# Altium schematic sheet GPIO_Headers.SchDoc: Headers
size A4; DocumentNumber: 8; Revision: 1.0; SheetNumber: 8; SheetTotal: 8; SheetSize: A4
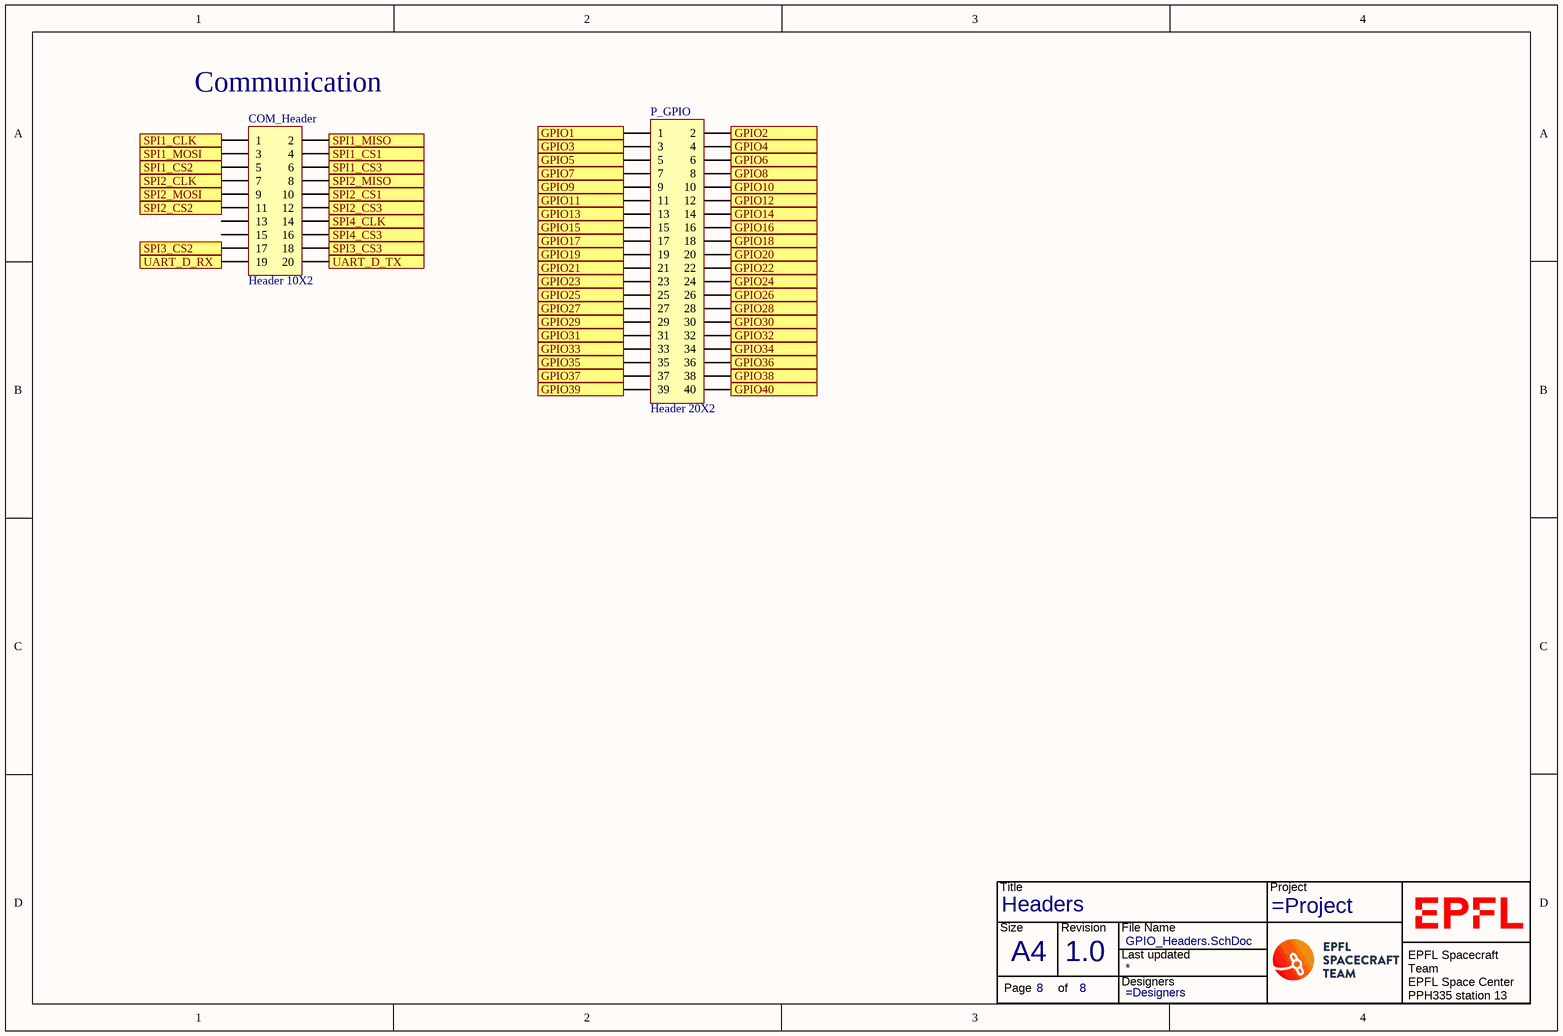
[diagram p0: GPIO_Headers.SchDoc]

## Parts
*  TitleBlock  (value not drawn)  (graphical)
COM_Header  Header 10X2  [HDR2X10]
P_GPIO  Header 20X2  [HDR2X20]

## Ports
GPIO1, GPIO2, GPIO3, GPIO4, GPIO5, GPIO6, GPIO7, GPIO8, GPIO9, GPIO10, GPIO11, GPIO12, GPIO13, GPIO14, GPIO15, GPIO16, GPIO17, GPIO18, GPIO19, GPIO20, GPIO21, GPIO22, GPIO23, GPIO24, GPIO25, GPIO26, GPIO27, GPIO28, GPIO29, GPIO30, GPIO31, GPIO32, GPIO33, GPIO34, GPIO35, GPIO36, GPIO37, GPIO38, GPIO39, GPIO40, SPI1_CLK, SPI1_CS1, SPI1_CS2, SPI1_CS3, SPI1_MISO, SPI1_MOSI, SPI2_CLK, SPI2_CS1, SPI2_CS2, SPI2_CS3, SPI2_MISO, SPI2_MOSI, SPI3_CS2, SPI3_CS3, SPI4_CLK, SPI4_CS3, UART_D_RX, UART_D_TX

## Nets
GPIO1: P_GPIO.1 ; port GPIO1
GPIO2: P_GPIO.2 ; port GPIO2
GPIO3: P_GPIO.3 ; port GPIO3
GPIO4: P_GPIO.4 ; port GPIO4
GPIO5: P_GPIO.5 ; port GPIO5
GPIO6: P_GPIO.6 ; port GPIO6
GPIO7: P_GPIO.7 ; port GPIO7
GPIO8: P_GPIO.8 ; port GPIO8
GPIO9: P_GPIO.9 ; port GPIO9
GPIO10: P_GPIO.10 ; port GPIO10
GPIO11: P_GPIO.11 ; port GPIO11
GPIO12: P_GPIO.12 ; port GPIO12
GPIO13: P_GPIO.13 ; port GPIO13
GPIO14: P_GPIO.14 ; port GPIO14
GPIO15: P_GPIO.15 ; port GPIO15
GPIO16: P_GPIO.16 ; port GPIO16
GPIO17: P_GPIO.17 ; port GPIO17
GPIO18: P_GPIO.18 ; port GPIO18
GPIO19: P_GPIO.19 ; port GPIO19
GPIO20: P_GPIO.20 ; port GPIO20
GPIO21: P_GPIO.21 ; port GPIO21
GPIO22: P_GPIO.22 ; port GPIO22
GPIO23: P_GPIO.23 ; port GPIO23
GPIO24: P_GPIO.24 ; port GPIO24
GPIO25: P_GPIO.25 ; port GPIO25
GPIO26: P_GPIO.26 ; port GPIO26
GPIO27: P_GPIO.27 ; port GPIO27
GPIO28: P_GPIO.28 ; port GPIO28
GPIO29: P_GPIO.29 ; port GPIO29
GPIO30: P_GPIO.30 ; port GPIO30
GPIO31: P_GPIO.31 ; port GPIO31
GPIO32: P_GPIO.32 ; port GPIO32
GPIO33: P_GPIO.33 ; port GPIO33
GPIO34: P_GPIO.34 ; port GPIO34
GPIO35: P_GPIO.35 ; port GPIO35
GPIO36: P_GPIO.36 ; port GPIO36
GPIO37: P_GPIO.37 ; port GPIO37
GPIO38: P_GPIO.38 ; port GPIO38
GPIO39: P_GPIO.39 ; port GPIO39
GPIO40: P_GPIO.40 ; port GPIO40
SPI1_CLK: COM_Header.1 ; port SPI1_CLK
SPI1_CS1: COM_Header.4 ; port SPI1_CS1
SPI1_CS2: COM_Header.5 ; port SPI1_CS2
SPI1_CS3: COM_Header.6 ; port SPI1_CS3
SPI1_MISO: COM_Header.2 ; port SPI1_MISO
SPI1_MOSI: COM_Header.3 ; port SPI1_MOSI
SPI2_CLK: COM_Header.7 ; port SPI2_CLK
SPI2_CS1: COM_Header.10 ; port SPI2_CS1
SPI2_CS2: COM_Header.11 ; port SPI2_CS2
SPI2_CS3: COM_Header.12 ; port SPI2_CS3
SPI2_MISO: COM_Header.8 ; port SPI2_MISO
SPI2_MOSI: COM_Header.9 ; port SPI2_MOSI
SPI3_CS2: COM_Header.17 ; port SPI3_CS2
SPI3_CS3: COM_Header.18 ; port SPI3_CS3
SPI4_CLK: COM_Header.14 ; port SPI4_CLK
SPI4_CS3: COM_Header.16 ; port SPI4_CS3
UART_D_RX: COM_Header.19 ; port UART_D_RX
UART_D_TX: COM_Header.20 ; port UART_D_TX

Not connected (* = marked no-connect by the designer): COM_Header 13 15

## Notes on the sheet
- (near COM_Header) Communication
- (in symbol TitleBlock) Title; Project; Size; Revision; File Name; Last updated; Designers; Page; of; EPFL Spacecraft Team / EPFL Space Center / PPH335 station 13 / CH-1015 Lausanne

## Library data of the parts
* = TitleBlock: Title Block with generall information
COM_Header = Header 10X2: Header, 10-Pin, Dual row; LatestRevisionDate: 17-Jul-2002; LatestRevisionNote: Re-released for DXP Platform.; Publisher: Altium Limited
P_GPIO = Header 20X2: Header, 20-Pin, Dual row; LatestRevisionDate: 17-Jul-2002; LatestRevisionNote: Re-released for DXP Platform.; Publisher: Altium Limited